# Altium project PCIe_to_M2E.PrjPcb (part 2 of 2)

## Sheet PowerControl.SchDoc
size C
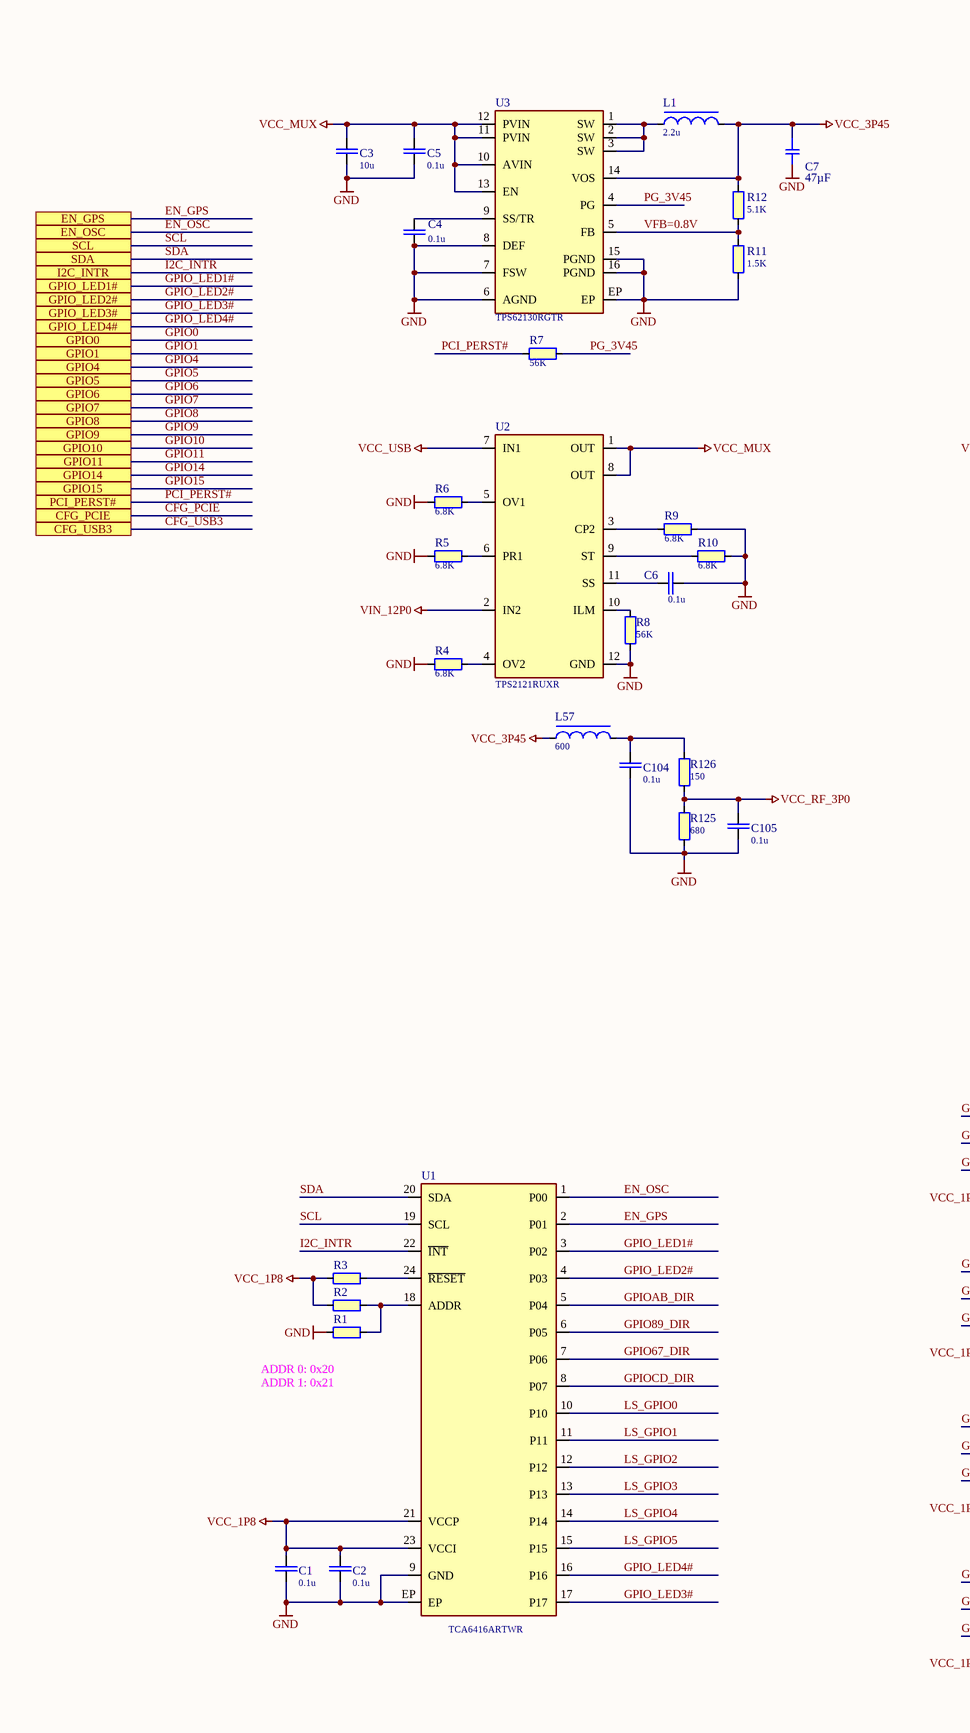
[diagram p4: PowerControl.SchDoc, left]
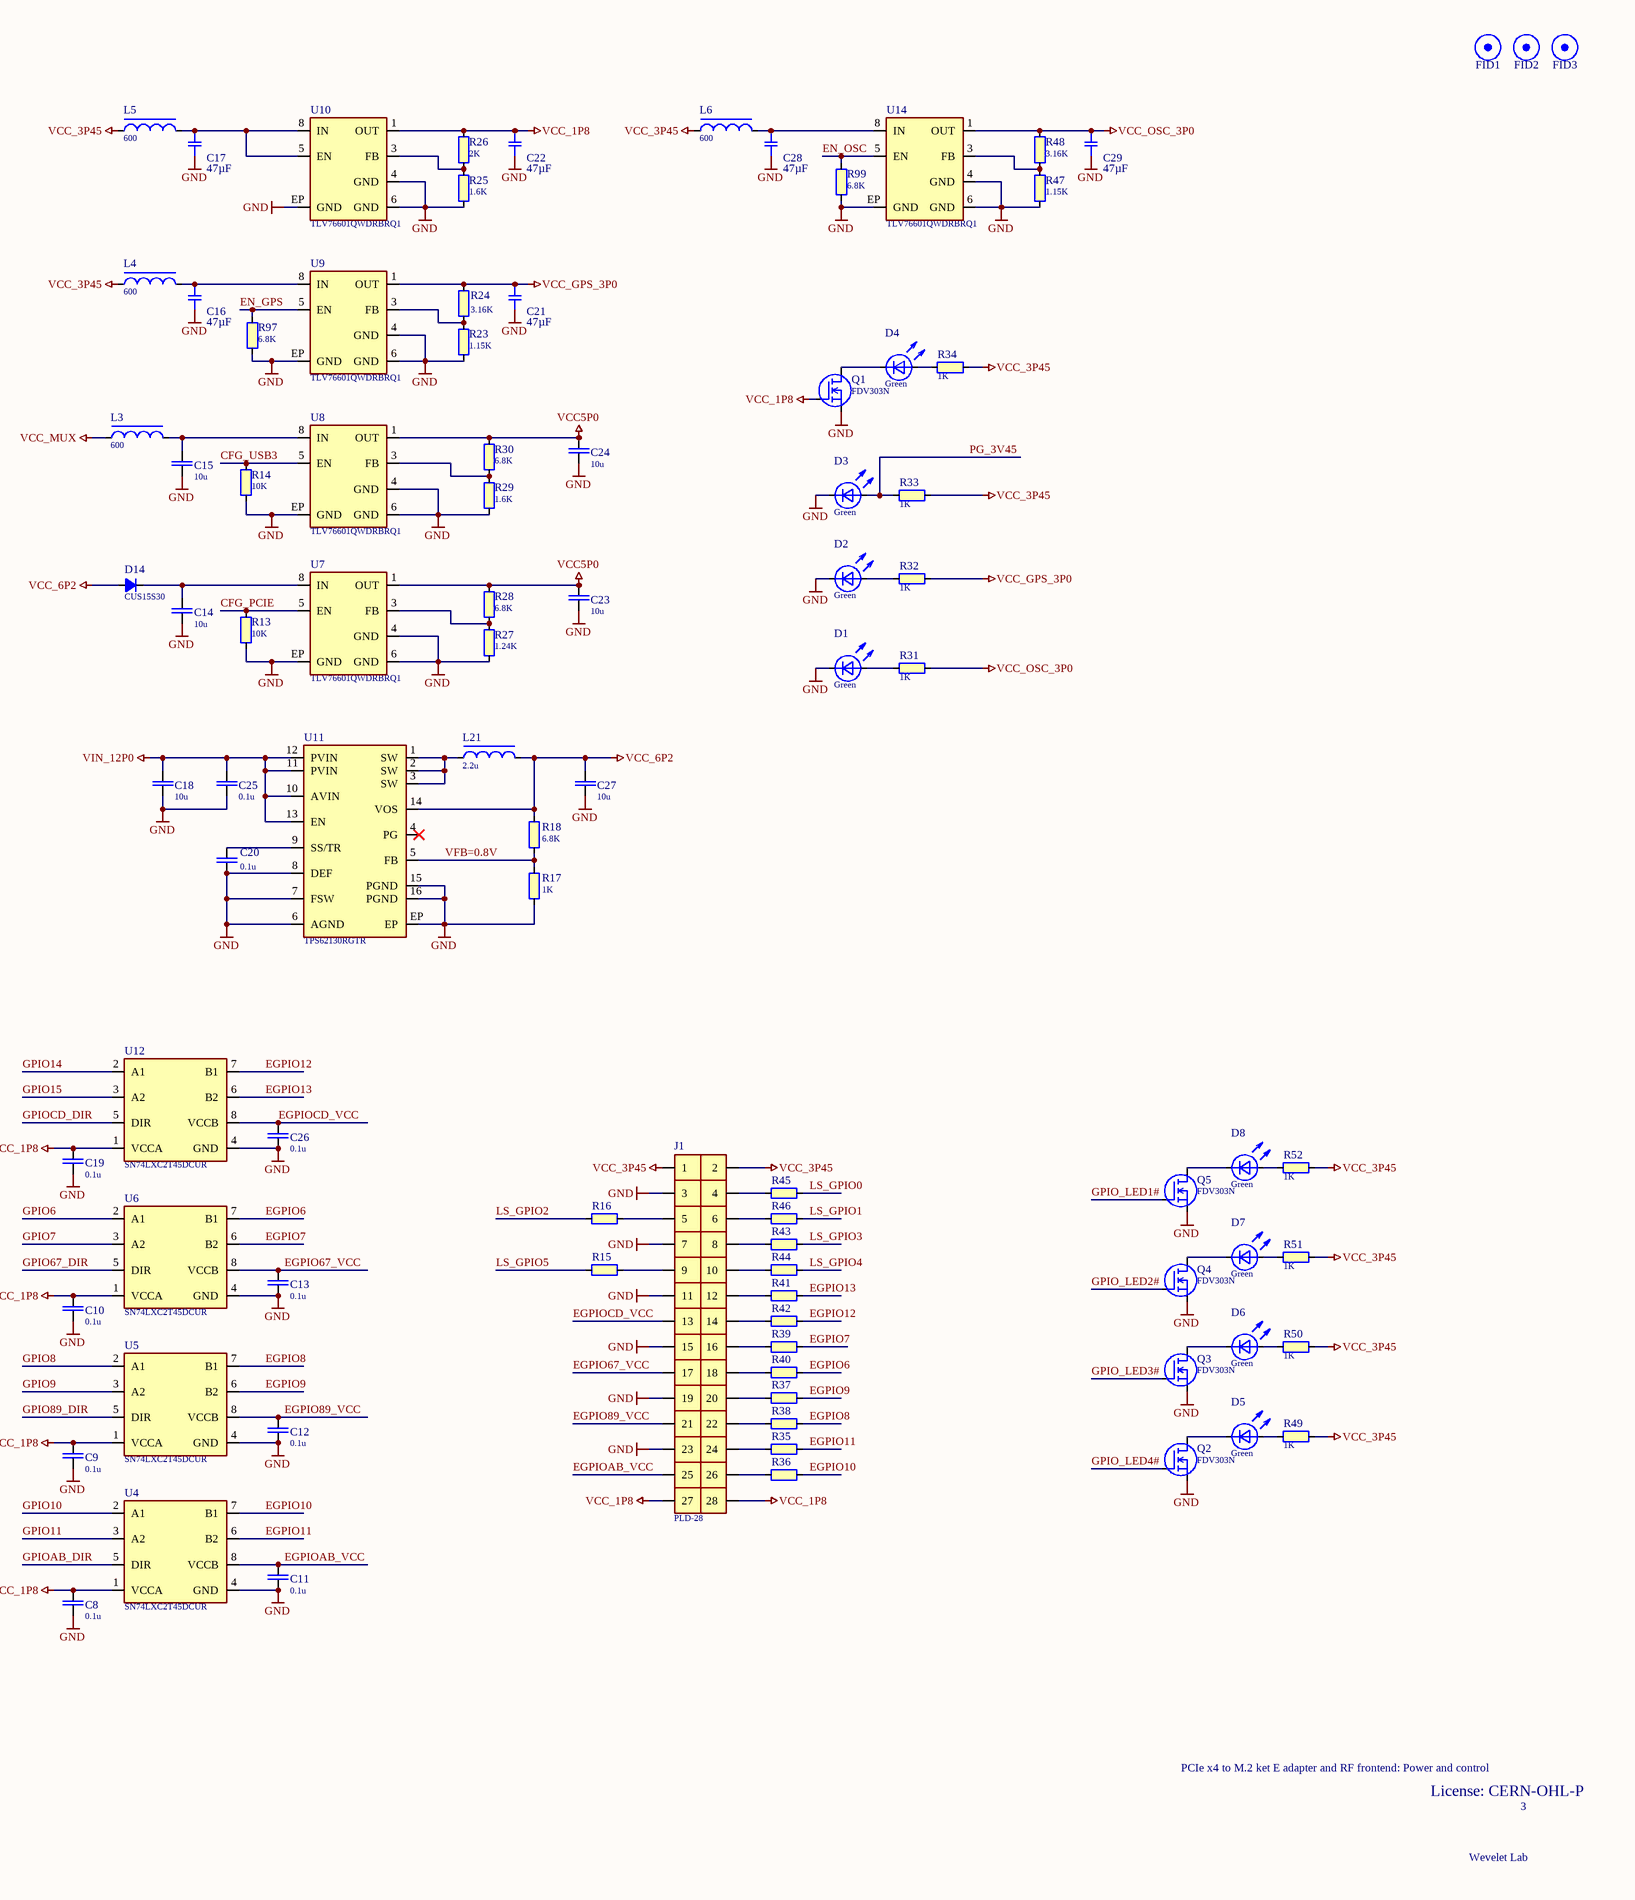
[diagram p5: PowerControl.SchDoc, right]

### Parts
C1  value 0.1u  [CAPC100X50X55L25N]  (hidden comment: GRM155R71E104KE14D)
C2  value 0.1u  [CAPC100X50X55L25N]  (hidden comment: GRM155R71E104KE14D)
C3  value 10u  [CAPC160X80X100L40N]  (hidden comment: Cap-0603-X5R-25V-10u-20%)
C4  value 0.1u  [CAPC100X50X55L25N]  (hidden comment: GRM155R71E104KE14D)
C5  value 0.1u  [CAPC100X50X55L25N]  (hidden comment: GRM155R71E104KE14D)
C6  value 0.1u  [CAPC100X50X55L25N]  (hidden comment: GRM155R71E104KE14D)
C7  value 47µF  [SMD-0603-CAP_HighDensity]  (hidden comment: GRM188C80G476ME01D)
C8  value 0.1u  [CAPC100X50X55L25N]  (hidden comment: GRM155R71E104KE14D)
C9  value 0.1u  [CAPC100X50X55L25N]  (hidden comment: GRM155R71E104KE14D)
C10  value 0.1u  [CAPC100X50X55L25N]  (hidden comment: GRM155R71E104KE14D)
C11  value 0.1u  [CAPC100X50X55L25N]  (hidden comment: GRM155R71E104KE14D)
C12  value 0.1u  [CAPC100X50X55L25N]  (hidden comment: GRM155R71E104KE14D)
C13  value 0.1u  [CAPC100X50X55L25N]  (hidden comment: GRM155R71E104KE14D)
C14  value 10u  [CAPC160X80X100L40N]  (hidden comment: Cap-0603-X5R-25V-10u-20%)
C15  value 10u  [CAPC160X80X100L40N]  (hidden comment: Cap-0603-X5R-25V-10u-20%)
C16  value 47µF  [SMD-0603-CAP_HighDensity]  (hidden comment: GRM188C80G476ME01D)
C17  value 47µF  [SMD-0603-CAP_HighDensity]  (hidden comment: GRM188C80G476ME01D)
C18  value 10u  [CAPC160X80X100L40N]  (hidden comment: Cap-0603-X5R-25V-10u-20%)
C19  value 0.1u  [CAPC100X50X55L25N]  (hidden comment: GRM155R71E104KE14D)
C20  value 0.1u  [CAPC100X50X55L25N]  (hidden comment: GRM155R71E104KE14D)
C21  value 47µF  [SMD-0603-CAP_HighDensity]  (hidden comment: GRM188C80G476ME01D)
C22  value 47µF  [SMD-0603-CAP_HighDensity]  (hidden comment: GRM188C80G476ME01D)
C23  value 10u  [CAPC160X80X100L40N]  (hidden comment: Cap-0603-X5R-25V-10u-20%)
C24  value 10u  [CAPC160X80X100L40N]  (hidden comment: Cap-0603-X5R-25V-10u-20%)
C25  value 0.1u  [CAPC100X50X55L25N]  (hidden comment: GRM155R71E104KE14D)
C26  value 0.1u  [CAPC100X50X55L25N]  (hidden comment: GRM155R71E104KE14D)
C27  value 10u  [CAPC160X80X100L40N]  (hidden comment: Cap-0603-X5R-25V-10u-20%)
C28  value 47µF  [SMD-0603-CAP_HighDensity]  (hidden comment: GRM188C80G476ME01D)
C29  value 47µF  [SMD-0603-CAP_HighDensity]  (hidden comment: GRM188C80G476ME01D)
C104  value 0.1u  [CAPC100X50X55L25N]  (hidden comment: GRM155R71E104KE14D)
C105  value 0.1u  [CAPC100X50X55L25N]  (hidden comment: GRM155R71E104KE14D)
D1  value Green  [LEDC160X80X80L40N-Green]  (hidden comment: LTST-C190KGKT)
D2  value Green  [LEDC160X80X80L40N-Green]  (hidden comment: LTST-C190KGKT)
D3  value Green  [LEDC160X80X80L40N-Green]  (hidden comment: LTST-C190KGKT)
D4  value Green  [LEDC160X80X80L40N-Green]  (hidden comment: LTST-C190KGKT)
D5  value Green  [LEDC160X80X80L40N-Green]  (hidden comment: LTST-C190KGKT)
D6  value Green  [LEDC160X80X80L40N-Green]  (hidden comment: LTST-C190KGKT)
D7  value Green  [LEDC160X80X80L40N-Green]  (hidden comment: LTST-C190KGKT)
D8  value Green  [LEDC160X80X80L40N-Green]  (hidden comment: LTST-C190KGKT)
D14  value CUS15S30  [INDC100X60X60L30N]  (hidden comment: CUS15S30,H3F)
FID1  Fiducial  [Fiducial_3D]  (value not drawn)  (no BOM)
FID2  Fiducial  [Fiducial_3D]  (value not drawn)  (no BOM)
FID3  Fiducial  [Fiducial_3D]  (value not drawn)  (no BOM)
J1  PLD-28  [PLD-28]
L1  value 2.2u  [IND_TAIYO_NRS5020]  (hidden comment: NRS5020T2R2NMGJ)
L3  value 600  [INDC100X60X60L30N]  (hidden comment: BLM15HG601SN1D)
L4  value 600  [INDC100X60X60L30N]  (hidden comment: BLM15HG601SN1D)
L5  value 600  [INDC100X60X60L30N]  (hidden comment: BLM15HG601SN1D)
L6  value 600  [INDC100X60X60L30N]  (hidden comment: BLM15HG601SN1D)
L21  value 2.2u  [IND_TAIYO_NRS5020]  (hidden comment: NRS5020T2R2NMGJ)
L57  value 600  [INDC100X60X60L30N]  (hidden comment: BLM15HG601SN1D)
Q1  FDV303N  [SOT23-3P95_245X110L45X44N]
Q2  FDV303N  [SOT23-3P95_245X110L45X44N]
Q3  FDV303N  [SOT23-3P95_245X110L45X44N]
Q4  FDV303N  [SOT23-3P95_245X110L45X44N]
Q5  FDV303N  [SOT23-3P95_245X110L45X44N]
R1  value DNP  [RESC100X50X40L20N]  (hidden comment: Res-0402-DNP)  (no BOM)
R2  value 33  [RESC100X50X40L20N]  (hidden comment: RC0402FR-0733RL)
R3  value 6.8K  [RESC100X50X40L20N]  (hidden comment: RC0402FR-076K8L)
R4  value 6.8K  [RESC100X50X40L20N]  (hidden comment: RC0402FR-076K8L)
R5  value 6.8K  [RESC100X50X40L20N]  (hidden comment: RC0402FR-076K8L)
R6  value 6.8K  [RESC100X50X40L20N]  (hidden comment: RC0402FR-076K8L)
R7  value 56K  [RESC100X50X40L20N]  (hidden comment: RC0402FR-0756KL)
R8  value 56K  [RESC100X50X40L20N]  (hidden comment: RC0402FR-0756KL)
R9  value 6.8K  [RESC100X50X40L20N]  (hidden comment: RC0402FR-076K8L)
R10  value 6.8K  [RESC100X50X40L20N]  (hidden comment: RC0402FR-076K8L)
R11  value 1.5K  [RESC100X50X40L20N]  (hidden comment: RC0402FR-071K5L)
R12  value 5.1K  [RESC100X50X40L20N]  (hidden comment: RC0402FR-075K1L)
R13  value 10K  [RESC100X50X40L20N]  (hidden comment: RC0402FR-0710KL)
R14  value 10K  [RESC100X50X40L20N]  (hidden comment: RC0402FR-0710KL)
R15  value 33  [RESC100X50X40L20N]  (hidden comment: RC0402FR-0733RL)
R16  value 33  [RESC100X50X40L20N]  (hidden comment: RC0402FR-0733RL)
R17  value 1K  [RESC100X50X40L20N]  (hidden comment: RC0402FR-071KL)
R18  value 6.8K  [RESC100X50X40L20N]  (hidden comment: RC0402FR-076K8L)
R23  value 1.15K  [RESC100X50X40L20N]  (hidden comment: RC0402FR-071K15L)
R24  value 3.16K  [RESC100X50X40L20N]  (hidden comment: RC0402FR-073K16L)
R25  value 1.6K  [RESC100X50X40L20N]  (hidden comment: RC0402FR-071K6L)
R26  value 2K  [RESC100X50X40L20N]  (hidden comment: RC0402FR-072KL)
R27  value 1.24K  [RESC100X50X40L20N]  (hidden comment: RC0402FR-071K24L)
R28  value 6.8K  [RESC100X50X40L20N]  (hidden comment: RC0402FR-076K8L)
R29  value 1.6K  [RESC100X50X40L20N]  (hidden comment: RC0402FR-071K6L)
R30  value 6.8K  [RESC100X50X40L20N]  (hidden comment: RC0402FR-076K8L)
R31  value 1K  [RESC100X50X40L20N]  (hidden comment: RC0402FR-071KL)
R32  value 1K  [RESC100X50X40L20N]  (hidden comment: RC0402FR-071KL)
R33  value 1K  [RESC100X50X40L20N]  (hidden comment: RC0402FR-071KL)
R34  value 1K  [RESC100X50X40L20N]  (hidden comment: RC0402FR-071KL)
R35  value 33  [RESC100X50X40L20N]  (hidden comment: RC0402FR-0733RL)
R36  value 33  [RESC100X50X40L20N]  (hidden comment: RC0402FR-0733RL)
R37  value 33  [RESC100X50X40L20N]  (hidden comment: RC0402FR-0733RL)
R38  value 33  [RESC100X50X40L20N]  (hidden comment: RC0402FR-0733RL)
R39  value 33  [RESC100X50X40L20N]  (hidden comment: RC0402FR-0733RL)
R40  value 33  [RESC100X50X40L20N]  (hidden comment: RC0402FR-0733RL)
R41  value 33  [RESC100X50X40L20N]  (hidden comment: RC0402FR-0733RL)
R42  value 33  [RESC100X50X40L20N]  (hidden comment: RC0402FR-0733RL)
R43  value 33  [RESC100X50X40L20N]  (hidden comment: RC0402FR-0733RL)
R44  value 33  [RESC100X50X40L20N]  (hidden comment: RC0402FR-0733RL)
R45  value 33  [RESC100X50X40L20N]  (hidden comment: RC0402FR-0733RL)
R46  value 33  [RESC100X50X40L20N]  (hidden comment: RC0402FR-0733RL)
R47  value 1.15K  [RESC100X50X40L20N]  (hidden comment: RC0402FR-071K15L)
R48  value 3.16K  [RESC100X50X40L20N]  (hidden comment: RC0402FR-073K16L)
R49  value 1K  [RESC100X50X40L20N]  (hidden comment: RC0402FR-071KL)
R50  value 1K  [RESC100X50X40L20N]  (hidden comment: RC0402FR-071KL)
R51  value 1K  [RESC100X50X40L20N]  (hidden comment: RC0402FR-071KL)
R52  value 1K  [RESC100X50X40L20N]  (hidden comment: RC0402FR-071KL)
R97  value 6.8K  [RESC100X50X40L20N]  (hidden comment: RC0402FR-076K8L)
R99  value 6.8K  [RESC100X50X40L20N]  (hidden comment: RC0402FR-076K8L)
R125  value 680  [RESC100X50X40L20N]  (hidden comment: RC0402FR-07680RL)
R126  value 150  [RESC100X50X40L20N]  (hidden comment: RC0402FR-07150RL)
U1  TCA6416ARTWR  [QFN25P50_400X400X80L40X24T250N]
U2  TPS2121RUXR  [QFN12P50_250X200X100L40X20N]
U3  TPS62130RGTR  [QFN17P50_300X300X100L40X24T170N]
U4  SN74LXC2T45DCUR  [SOP8P50_200X310X90L27X21N]
U5  SN74LXC2T45DCUR  [SOP8P50_200X310X90L27X21N]
U6  SN74LXC2T45DCUR  [SOP8P50_200X310X90L27X21N]
U7  TLV76601QWDRBRQ1  [SON9P65_300X300X100L40X31T250X175N]
U8  TLV76601QWDRBRQ1  [SON9P65_300X300X100L40X31T250X175N]
U9  TLV76601QWDRBRQ1  [SON9P65_300X300X100L40X31T250X175N]
U10  TLV76601QWDRBRQ1  [SON9P65_300X300X100L40X31T250X175N]
U11  TPS62130RGTR  [QFN17P50_300X300X100L40X24T170N]
U12  SN74LXC2T45DCUR  [SOP8P50_200X310X90L27X21N]
U14  TLV76601QWDRBRQ1  [SON9P65_300X300X100L40X31T250X175N]

### Ports
CFG_PCIE, CFG_USB3, EN_GPS, EN_OSC, GPIO0, GPIO1, GPIO4, GPIO5, GPIO6, GPIO7, GPIO8, GPIO9, GPIO10, GPIO11, GPIO14, GPIO15, GPIO_LED1#, GPIO_LED2#, GPIO_LED3#, GPIO_LED4#, I2C_INTR, PCI_PERST#, SCL, SDA

### Nets
GND: C1.1 C2.1 C3.2 C4.2 C5.2 C6.2 C7.2 C8.2 C9.2 C10.2 C11.1 C12.1 C13.1 C14.2 C15.2 C16.2 C17.2 C18.2 C19.2 C20.2 C21.2 C22.2 C23.2 C24.2 C25.2 C26.1 C27.2 C28.2 C29.2 C104.2 C105.2 D1.C D2.C D3.C J1.3 J1.7 J1.11 J1.15 J1.19 J1.23 Q1.2(S) Q2.2(S) Q3.2(S) Q4.2(S) Q5.2(S) R1.1 R4.1 R5.1 R6.1 R8.1 R9.2 R10.2 R11.1 R13.1 R14.1 R17.1 R23.1 R25.1 R27.1 R29.1 R47.1 R97.1 R99.1 R125.1 U1.9(GND) U1.EP U2.12(GND) U3.6(AGND) U3.7(FSW) U3.8(DEF) U3.15(PGND) U3.16(PGND) U3.EP U4.4(GND) U5.4(GND) U6.4(GND) U7.4(GND) U7.6(GND) U7.EP(GND) U8.4(GND) U8.6(GND) U8.EP(GND) U9.4(GND) U9.6(GND) U9.EP(GND) U10.4(GND) U10.6(GND) U10.EP(GND) U11.6(AGND) U11.7(FSW) U11.8(DEF) U11.15(PGND) U11.16(PGND) U11.EP U12.4(GND) U14.4(GND) U14.6(GND) U14.EP(GND)
VCC5P0: C23.1 C24.1 R28.2 R30.2 U7.1(OUT) U8.1(OUT)
VCC_1P8: C1.2 C2.2 C8.1 C9.1 C10.1 C19.1 C22.1 J1.27 J1.28 Q1.1(G) R2.1 R3.1 R26.2 U1.21(VCCP) U1.23(VCCI) U4.1(VCCA) U5.1(VCCA) U6.1(VCCA) U10.1(OUT) U12.1(VCCA)
VCC_3P45: C7.1 J1.1 J1.2 L1.2 L4.1 L5.1 L6.1 L57.1 R12.2 R33.2 R34.2 R49.2 R50.2 R51.2 R52.2 U3.14(VOS)
VCC_6P2: C27.1 D14.A L21.2 R18.2 U11.14(VOS)
VCC_GPS_3P0: C21.1 R24.2 R32.2 U9.1(OUT)
VCC_MUX: C3.1 C5.1 L3.1 U2.1(OUT) U2.8(OUT) U3.10(AVIN) U3.11(PVIN) U3.12(PVIN) U3.13(EN)
VCC_OSC_3P0: C29.1 R31.2 R48.2 U14.1(OUT)
VCC_RF_3P0: C105.1 R125.2 R126.1
VCC_USB: U2.7(IN1)
VIN_12P0: C18.1 C25.1 U2.2(IN2) U11.10(AVIN) U11.11(PVIN) U11.12(PVIN) U11.13(EN)
CFG_PCIE: R13.2 U7.5(EN) ; port CFG_PCIE
CFG_USB3: R14.2 U8.5(EN) ; port CFG_USB3
EGPIO6: R40.2 U6.7(B1)
EGPIO7: R39.2 U6.6(B2)
EGPIO8: R38.2 U5.7(B1)
EGPIO9: R37.2 U5.6(B2)
EGPIO10: R36.2 U4.7(B1)
EGPIO11: R35.2 U4.6(B2)
EGPIO12: R42.2 U12.7(B1)
EGPIO13: R41.2 U12.6(B2)
EGPIO67_VCC: C13.2 J1.17 U6.8(VCCB)
EGPIO89_VCC: C12.2 J1.21 U5.8(VCCB)
EGPIOAB_VCC: C11.2 J1.25 U4.8(VCCB)
EGPIOCD_VCC: C26.2 J1.13 U12.8(VCCB)
EN_GPS: R97.2 U1.2(P01) U9.5(EN) ; port EN_GPS
EN_OSC: R99.2 U1.1(P00) U14.5(EN) ; port EN_OSC
GPIO6: U6.2(A1) ; port GPIO6
GPIO7: U6.3(A2) ; port GPIO7
GPIO8: U5.2(A1) ; port GPIO8
GPIO9: U5.3(A2) ; port GPIO9
GPIO10: U4.2(A1) ; port GPIO10
GPIO11: U4.3(A2) ; port GPIO11
GPIO14: U12.2(A1) ; port GPIO14
GPIO15: U12.3(A2) ; port GPIO15
GPIO67_DIR: U1.7(P06) U6.5(DIR)
GPIO89_DIR: U1.6(P05) U5.5(DIR)
GPIO_LED1#: Q5.1(G) U1.3(P02) ; port GPIO_LED1#
GPIO_LED2#: Q4.1(G) U1.4(P03) ; port GPIO_LED2#
GPIO_LED3#: Q3.1(G) U1.17(P17) ; port GPIO_LED3#
GPIO_LED4#: Q2.1(G) U1.16(P16) ; port GPIO_LED4#
GPIOAB_DIR: U1.5(P04) U4.5(DIR)
GPIOCD_DIR: U1.8(P07) U12.5(DIR)
I2C_INTR: U1.22(~{INT}) ; port I2C_INTR
LS_GPIO0: R45.2 U1.10(P10)
LS_GPIO1: R46.2 U1.11(P11)
LS_GPIO2: R16.1 U1.12(P12)
LS_GPIO3: R43.2 U1.13(P13)
LS_GPIO4: R44.2 U1.14(P14)
LS_GPIO5: R15.1 U1.15(P15)
PCI_PERST#: R7.1 ; port PCI_PERST#
PG_3V45: D3.A R7.2 R33.1 U3.4(PG)
SCL: U1.19(SCL) ; port SCL
SDA: U1.20(SDA) ; port SDA
NetC4_1: C4.1 U3.9(SS/TR)
NetC6_1: C6.1 U2.11(SS)
NetC14_1: C14.1 D14.C U7.8(IN)
NetC15_1: C15.1 L3.2 U8.8(IN)
NetC16_1: C16.1 L4.2 U9.8(IN)
NetC17_1: C17.1 L5.2 U10.5(EN) U10.8(IN)
NetC20_1: C20.1 U11.9(SS/TR)
NetC28_1: C28.1 L6.2 U14.8(IN)
NetC104_1: C104.1 L57.2 R126.2
NetD1_A: D1.A R31.1
NetD2_A: D2.A R32.1
NetD4_A: D4.A R34.1
NetD4_C: D4.C Q1.3(D)
NetD5_A: D5.A R49.1
NetD5_C: D5.C Q2.3(D)
NetD6_A: D6.A R50.1
NetD6_C: D6.C Q3.3(D)
NetD7_A: D7.A R51.1
NetD7_C: D7.C Q4.3(D)
NetD8_A: D8.A R52.1
NetD8_C: D8.C Q5.3(D)
NetJ1_4: J1.4 R45.1
NetJ1_5: J1.5 R16.2
NetJ1_6: J1.6 R46.1
NetJ1_8: J1.8 R43.1
NetJ1_9: J1.9 R15.2
NetJ1_10: J1.10 R44.1
NetJ1_12: J1.12 R41.1
NetJ1_14: J1.14 R42.1
NetJ1_16: J1.16 R39.1
NetJ1_18: J1.18 R40.1
NetJ1_20: J1.20 R37.1
NetJ1_22: J1.22 R38.1
NetJ1_24: J1.24 R35.1
NetJ1_26: J1.26 R36.1
NetL1_1: L1.1 U3.1(SW) U3.2(SW) U3.3(SW)
NetL21_1: L21.1 U11.1(SW) U11.2(SW) U11.3(SW)
NetR1_2: R1.2 R2.2 U1.18(ADDR)
NetR3_2: R3.2 U1.24(~{RESET})
NetR4_2: R4.2 U2.4(OV2)
NetR5_2: R5.2 U2.6(PR1)
NetR6_2: R6.2 U2.5(OV1)
NetR8_2: R8.2 U2.10(ILM)
NetR9_1: R9.1 U2.3(CP2)
NetR10_1: R10.1 U2.9(ST)
NetR11_2: R11.2 R12.1 U3.5(FB)
NetR17_2: R17.2 R18.1 U11.5(FB)
NetR23_2: R23.2 R24.1 U9.3(FB)
NetR25_2: R25.2 R26.1 U10.3(FB)
NetR27_2: R27.2 R28.1 U7.3(FB)
NetR29_2: R29.2 R30.1 U8.3(FB)
NetR47_2: R47.2 R48.1 U14.3(FB)

Not connected (* = marked no-connect by the designer): U11 4(PG)*

### Notes on the sheet
- VFB=0.8V
- (near R1) ADDR 0: 0x20
- (near R1) ADDR 1: 0x21
- PCIe x4 to M.2 ket E adapter and RF frontend: Power and control
- License: CERN-OHL-P
- Wevelet Lab
- 3

### Library data of the parts
C1 C2 C4-C6 C8-C13 C19 C20 C25 C26 C104 C105 = GRM155R71E104KE14D: Capacitor, 0.1u, 25V, 10%, X7R, 0402; Manufacturer: Murata Electronics
C3 C14 C15 C18 C23 C24 C27 = Cap-0603-X5R-25V-10u-20%: Capacitor, 10u, 25V, 20%, X5R, 0603; Manufacturer: *
C7 C16 C17 C21 C22 C28 C29 = GRM188C80G476ME01D: CAP CER 47UF 4V X6S 0603; Manufacturer: Murata Electronics North America; Tolerance: ±20%; Datasheets: https://www.murata.com/-/media/webrenewal/support/library/catalog/products/capacitor/ceramiccapacitor/c02e.ashx?la=en-us&cvid=20210120024548000000; Digi-Key Part Number: 490-13246-2-ND; Part Number: GRM188C80G476ME01D; Series: GRM; Part Status: Active; Voltage: 4V; Temperature Coefficient: X6S; Operating Temperature: -55°C ~ 105°C; Applications: General Purpose; Failure Rate: Surface Mount, MLCC; Mounting Type: 0603 (1608 Metric); Package / Case: 0.063" L x 0.031" W (1.60mm x 0.80mm)
D1-D8 = LTST-C190KGKT: LED Diode, Green, -30/+85, SMD0603; Manufacturer: Lite-On Inc.
D14 = CUS15S30: Diode, Schottky, 20V, 1.5A, 0.3Vf, -50/+125, SOD-323-2; Manufacturer: Toshiba
J1 = PLD-28: Conn, Header 12x2, 2.54mm, Trough Hole; Manufacturer: *; Value: PLD-28
L1 L21 = NRS5020T2R2NMGJ: Inductor, 2.2u, 2,9A, 42mOhm, +/-30%, -25/+125, SMD; Manufacturer: Taiyo Yuden
L3-L6 L57 = BLM15HG601SN1D: Ferrite bead, 600Ohm@100MHz, 0,3A, 700mOhm, -55/+125, SMD0402; Manufacturer: Murata Electronics; Name: BLM15HG601SN1D
Q1-Q5 = FDV303N: Transistor, MOSFET, N-CH, 25V, 0.68A, -55/+150, SOT-23; Manufacturer: Onsemi; Value: FDV303N
R1 = Res-0402-DNP: Resistor, DNP, 0.063W, 5%, 0402; Manufacturer: *
R2 R15 R16 R35-R46 = Res-0402-33-5%: Resistor, 33, 0.063W, 5%, 0402; Manufacturer: *; Name: RC0402FR-0733RL
R3-R6 R9 R10 R18 R28 R30 R97 R99 = Res-0402-6.8K-1%: Resistor, 6.8K, 0.063W, 1%, 0402; Manufacturer: *; Name: RC0402FR-076K8L
R7 R8 = Res-0402-56K-5%: Resistor, 56K, 0.063W, 5%, 0402; Manufacturer: *; Name: RC0402FR-0756KL
R11 = Res-0402-1.5K-1%: Resistor, 1.5K, 0.063W, 1%, 0402; Manufacturer: *; Name: RC0402FR-071K5L
R12 = Res-0402-5.1K-1%: Resistor, 5.1K, 0.063W, 1%, 0402; Manufacturer: *; Name: RC0402FR-075K1L
R13 R14 = Res-0402-10K-5%: Resistor, 10K, 0.063W, 5%, 0402; Manufacturer: *; Name: RC0402FR-0710KL
R17 R31-R34 R49-R52 = Res-0402-1K-5%: Resistor, 1K, 0.063W, 5%, 0402; Manufacturer: *; Name: RC0402FR-071KL
R23 R47 = Res-0402-1.15K-1%: Resistor, 1.15K, 0.063W, 1%, 0402; Manufacturer: *; Name: RC0402FR-071K15L
R24 R48 = Res-0402-3.16K-1%: Resistor, 3.16K, 0.063W, 1%, 0402; Manufacturer: *; Name: RC0402FR-073K16L
R25 R29 = Res-0402-1.6K-1%: Resistor, 1.6K, 0.063W, 1%, 0402; Manufacturer: *; Name: RC0402FR-071K6L
R26 = Res-0402-2K-1%: Resistor, 2K, 0.063W, 1%, 0402; Manufacturer: *; Name: RC0402FR-072KL
R27 = Res-0402-1.24K-1%: Resistor, 1.24K, 0.063W, 1%, 0402; Manufacturer: *; Name: RC0402FR-071K24L
R125 = Res-0402-680-5%: Resistor, 680, 0.063W, 5%, 0402; Manufacturer: *; Name: RC0402FR-07680RL
R126 = Res-0402-150-5%: Resistor, 150, 0.063W, 5%, 0402; Manufacturer: *; Name: RC0402FR-07150RL
U1 = TCA6416ARTWR: IC, Expander, 16-bit, 400KHZ, I2C, SMBUS, 1.65-5.5V, -40/+85, 24-WQFN (4x4); Manufacturer: TI; Value: TCA6416ARTWR
U2 = TPS2121RUXR: IC, QR controller, 2:1, 2.8/24V, 1/4.5A, -40/+125, VQFN-12; Manufacturer: Texas Instruments; Value: TPS2121RUXR
U3 U11 = TPS62130RGTR: IC, DC/DC, Step-Down, 3-17/0.9-6V, 3A, -40/+85, QFN-16; Manufacturer: Texas Instruments; Value: TPS62130RGTR
U4-U6 U12 = SN74LXC2T45DCUR: IC, Transceiver, Bidirectional, 1.1-5.5V, -40/+125, 8VSSOP; Manufacturer: TI; Value: SN74LXC2T45DCUR
U7-U10 U14 = TLV76601QWDRBRQ1: IC, VolReg, DC/DC, 2.5/16V, 0.8/14,6V, 0.5A, -40/+150, 8-SON; Manufacturer: Texas Instruments; Value: TLV76601QWDRBRQ1
FID1-FID3 = Fiducial: Manufacturer: *; Value: *

## Sheet RFEv2_1.SchDoc
size A3
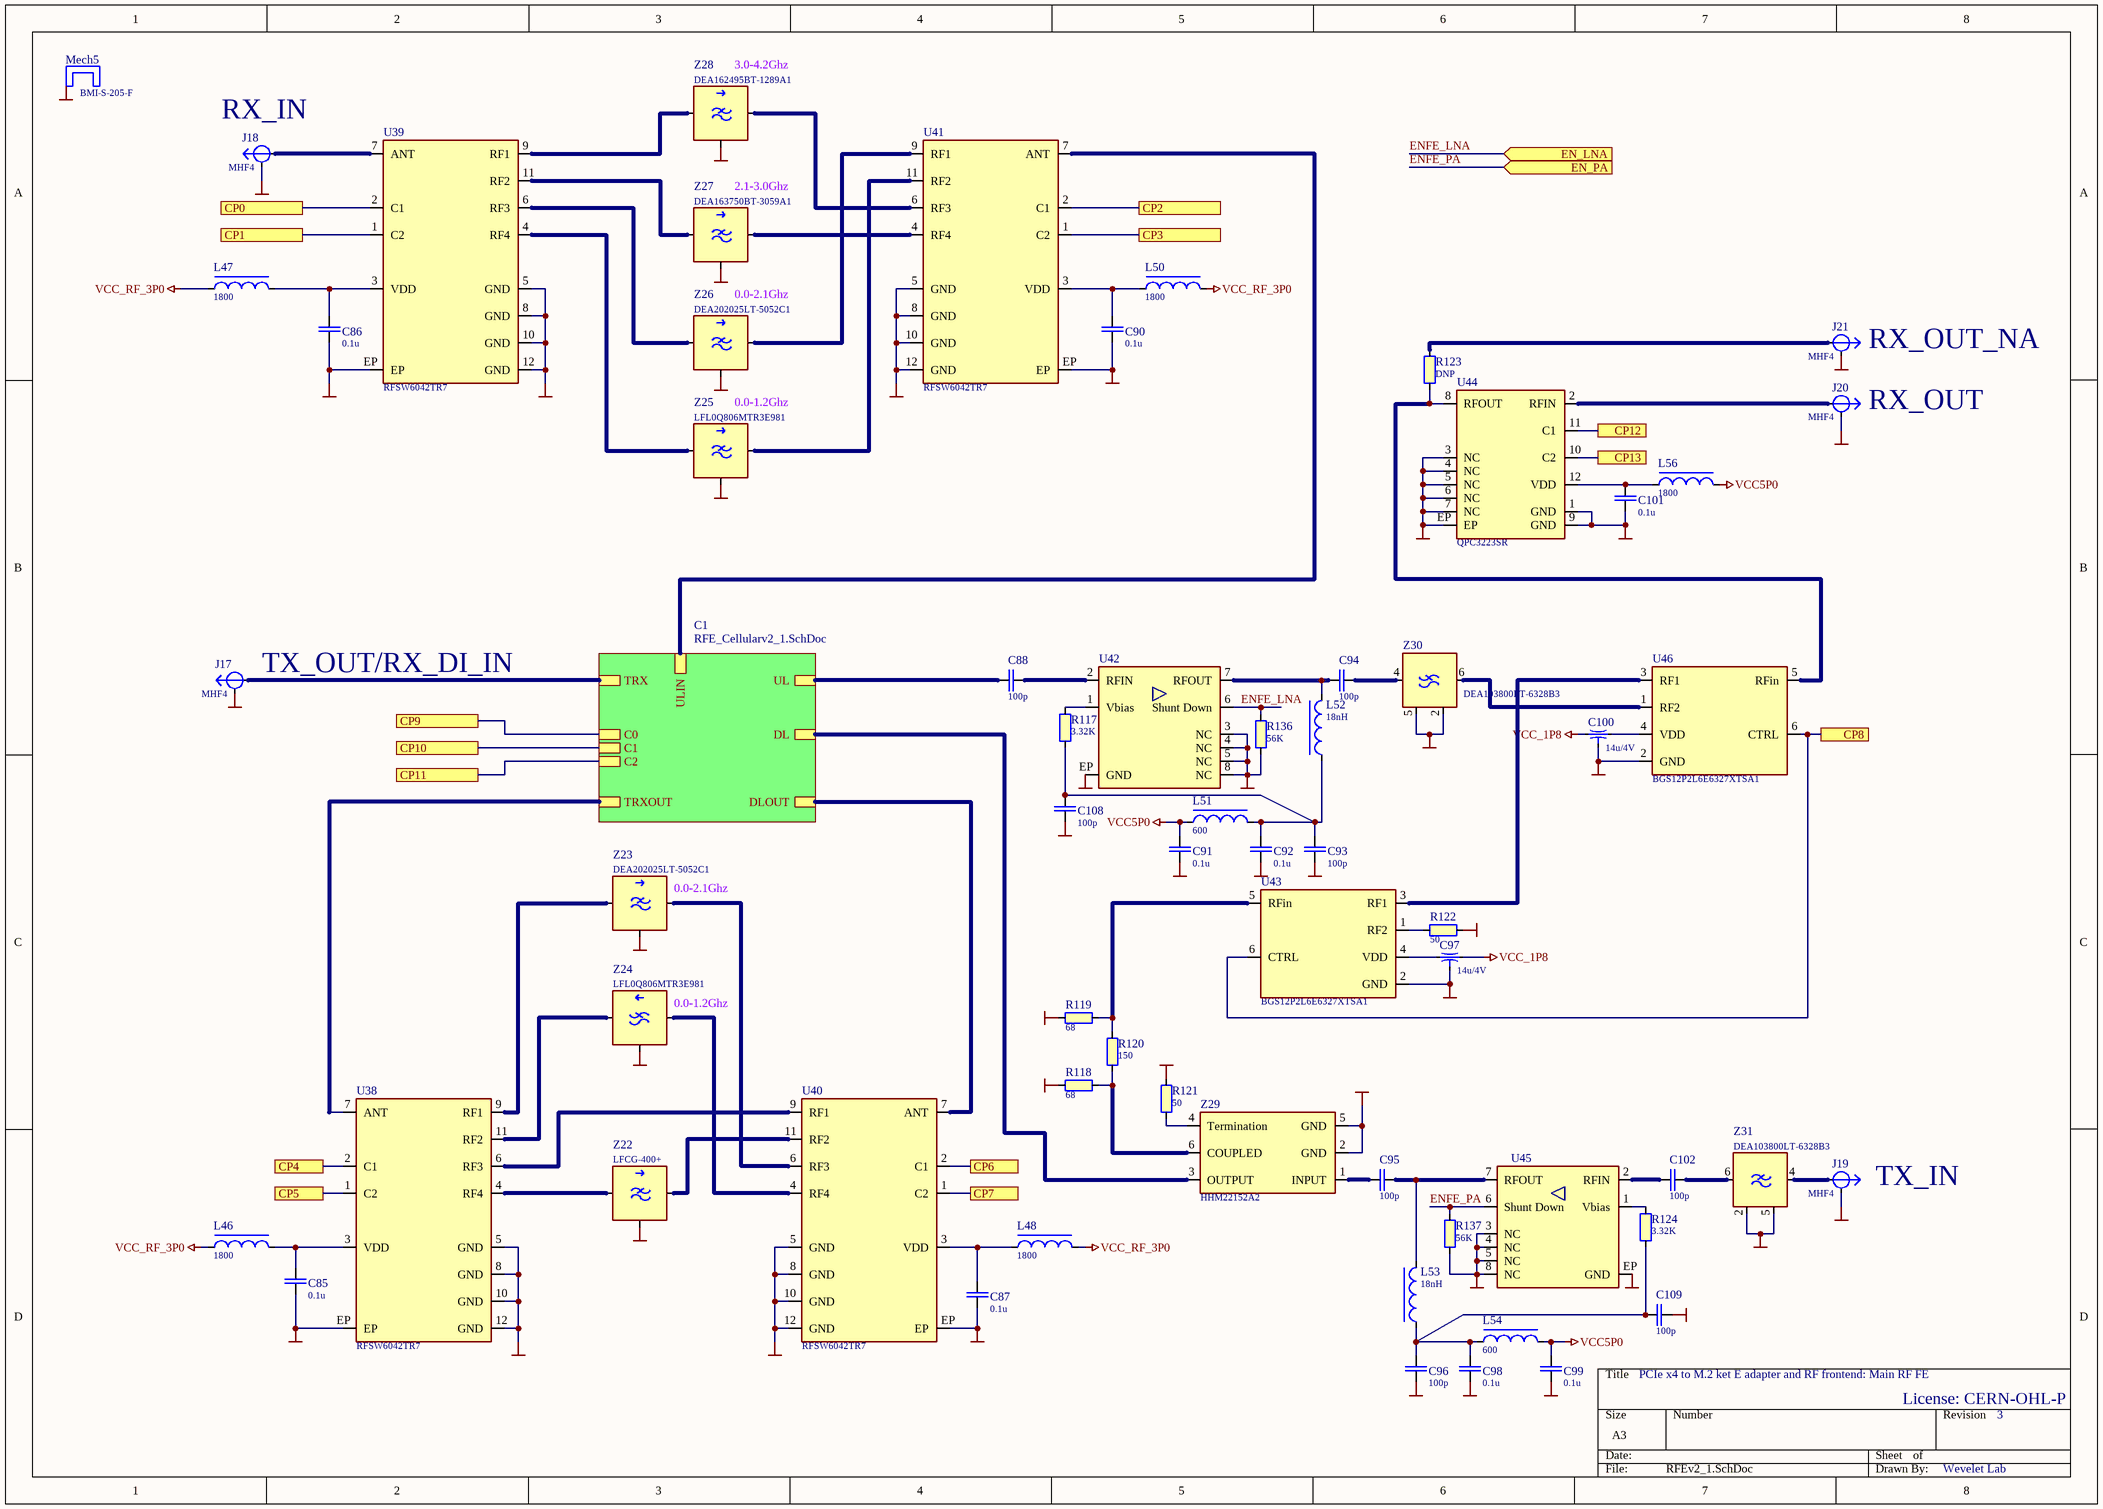
[diagram p6: RFEv2_1.SchDoc]

### Parts
C85  value 0.1u  [CAPC100X50X55L25N]  (hidden comment: GRM155R71E104KE14D)
C86  value 0.1u  [CAPC100X50X55L25N]  (hidden comment: GRM155R71E104KE14D)
C87  value 0.1u  [CAPC100X50X55L25N]  (hidden comment: GRM155R71E104KE14D)
C88  value 100p  [CAPC100X50X55L25N]  (hidden comment: Cap-0402-NP0-50V-100p-20%)
C90  value 0.1u  [CAPC100X50X55L25N]  (hidden comment: GRM155R71E104KE14D)
C91  value 0.1u  [CAPC100X50X55L25N]  (hidden comment: GRM155R71E104KE14D)
C92  value 0.1u  [CAPC100X50X55L25N]  (hidden comment: GRM155R71E104KE14D)
C93  value 100p  [CAPC100X50X55L25N]  (hidden comment: Cap-0402-NP0-50V-100p-20%)
C94  value 100p  [CAPC100X50X55L25N]  (hidden comment: Cap-0402-NP0-50V-100p-20%)
C95  value 100p  [CAPC100X50X55L25N]  (hidden comment: Cap-0402-NP0-50V-100p-20%)
C96  value 100p  [CAPC100X50X55L25N]  (hidden comment: Cap-0402-NP0-50V-100p-20%)
C97  value 14u/4V  [CAPCEMI100X50X50L20N]  (hidden comment: NFM15PC146R0G3D)
C98  value 0.1u  [CAPC100X50X55L25N]  (hidden comment: GRM155R71E104KE14D)
C99  value 0.1u  [CAPC100X50X55L25N]  (hidden comment: GRM155R71E104KE14D)
C100  value 14u/4V  [CAPCEMI100X50X50L20N]  (hidden comment: NFM15PC146R0G3D)
C101  value 0.1u  [CAPC100X50X55L25N]  (hidden comment: GRM155R71E104KE14D)
C102  value 100p  [CAPC100X50X55L25N]  (hidden comment: Cap-0402-NP0-50V-100p-20%)
C108  value 100p  [CAPC100X50X55L25N]  (hidden comment: Cap-0402-NP0-50V-100p-20%)
C109  value 100p  [CAPC100X50X55L25N]  (hidden comment: Cap-0402-NP0-50V-100p-20%)
J17  value MHF4  [LINX_CONMHF4-SMD-G-T]  (hidden comment: CONMHF4-SMD-G-T)
J18  value MHF4  [LINX_CONMHF4-SMD-G-T]  (hidden comment: CONMHF4-SMD-G-T)
J19  value MHF4  [LINX_CONMHF4-SMD-G-T]  (hidden comment: CONMHF4-SMD-G-T)
J20  value MHF4  [LINX_CONMHF4-SMD-G-T]  (hidden comment: CONMHF4-SMD-G-T)
J21  value MHF4  [LINX_CONMHF4-SMD-G-T]  (hidden comment: CONMHF4-SMD-G-T)
L46  value 1800  [INDC100X60X60L30N]  (hidden comment: BLM15HD182SN1D)
L47  value 1800  [INDC100X60X60L30N]  (hidden comment: BLM15HD182SN1D)
L48  value 1800  [INDC100X60X60L30N]  (hidden comment: BLM15HD182SN1D)
L50  value 1800  [INDC100X60X60L30N]  (hidden comment: BLM15HD182SN1D)
L51  value 600  [INDC100X60X60L30N]  (hidden comment: BLM15HG601SN1D)
L52  value 18nH  [CAPC100X50X55L25N]  (hidden comment: MLK1005S18NJT000)
L53  value 18nH  [CAPC100X50X55L25N]  (hidden comment: MLK1005S18NJT000)
L54  value 600  [INDC100X60X60L30N]  (hidden comment: BLM15HG601SN1D)
L56  value 1800  [INDC100X60X60L30N]  (hidden comment: BLM15HD182SN1D)
Mech5  BMI-S-205-F  [LAIRD_BMI-S-205]
R117  value 3.32K  [RESC100X50X40L20N]  (hidden comment: RC0402FR-073K32L)
R118  value 68  [RESC100X50X40L20N]  (hidden comment: RC0402FR-0768RL)
R119  value 68  [RESC100X50X40L20N]  (hidden comment: RC0402FR-0768RL)
R120  value 150  [RESC100X50X40L20N]  (hidden comment: RC0402FR-07150RL)
R121  value 50  [RESC100X50X40L20N]  (hidden comment: RC0402FR-0750RL)
R122  value 50  [RESC100X50X40L20N]  (hidden comment: RC0402FR-0750RL)
R123  value DNP  [RESC100X50X40L20N]  (hidden comment: Res-0402-DNP)  (no BOM)
R124  value 3.32K  [RESC100X50X40L20N]  (hidden comment: RC0402FR-073K32L)
R136  value 56K  [RESC100X50X40L20N]  (hidden comment: RC0402FR-0756KL)
R137  value 56K  [RESC100X50X40L20N]  (hidden comment: RC0402FR-0756KL)
U38  RFSW6042TR7  [QFN13P40_180X180X60L25X18T80N]
U39  RFSW6042TR7  [QFN13P40_180X180X60L25X18T80N]
U40  RFSW6042TR7  [QFN13P40_180X180X60L25X18T80N]
U41  RFSW6042TR7  [QFN13P40_180X180X60L25X18T80N]
U42  QPL9547TR7  [SON9P50_200X200X100L30X25T160X80N]
U43  BGS12P2L6E6327XTSA1  [PSON6P40_110X70X32L20X20N]
U44  QPC3223SR  [QFN13P50_300X300X90L50X23T120N]
U45  QPL9547TR7  [SON9P50_200X200X100L30X25T160X80N]
U46  BGS12P2L6E6327XTSA1  [PSON6P40_110X70X32L20X20N]
Z22  LFCG-400+  [Mini-Circuits_ GE0805C-2]
Z23  DEA202025LT-5052C1  [TDK_DEA202025LT-5052C1]
Z24  LFL0Q806MTR3E981  [MURATA_LFL0Q806MTR3E981]
Z25  LFL0Q806MTR3E981  [MURATA_LFL0Q806MTR3E981]
Z26  DEA202025LT-5052C1  [TDK_DEA202025LT-5052C1]
Z27  DEA163750BT-3059A1  [TDK_DEA163750BT-3059A1]
Z28  DEA162495BT-1289A1  [TDK_DEA162495BT-1289A1]
Z29  HHM22152A2  [TDK_HHM22152A2]
Z30  DEA103800LT-6328B3  [TDK_DEA10-L]
Z31  DEA103800LT-6328B3  [TDK_DEA10-L]

### Sub-sheets
C1 = RFE_Cellularv2_1.SchDoc: TRX, UL, DL, C0, C1, C2, ULIN, DLOUT, TRXOUT

### Ports
CP0, CP1, CP2, CP3, CP4, CP5, CP6, CP7, CP8, CP9, CP10, CP11, CP12, CP13, EN_LNA (in), EN_PA (in)

### Nets
GND: C85.2 C86.2 C87.2 C90.2 C91.2 C92.2 C93.1 C96.1 C97.2(GND) C98.2 C99.2 C100.2(GND) C101.2 C108.1 C109.1 J17.SH J18.SH J19.SH J20.SH J21.SH Mech5.SH R118.1 R119.1 R121.2 R122.2 R136.1 R137.1 U38.5(GND) U38.8(GND) U38.10(GND) U38.12(GND) U38.EP U39.5(GND) U39.8(GND) U39.10(GND) U39.12(GND) U39.EP U40.5(GND) U40.8(GND) U40.10(GND) U40.12(GND) U40.EP U41.5(GND) U41.8(GND) U41.10(GND) U41.12(GND) U41.EP U42.3(NC) U42.4(NC) U42.5(NC) U42.8(NC) U42.EP(GND) U43.2(GND) U44.1(GND) U44.3(NC) U44.4(NC) U44.5(NC) U44.6(NC) U44.7(NC) U44.9(GND) U44.EP U45.3(NC) U45.4(NC) U45.5(NC) U45.8(NC) U45.EP(GND) U46.2(GND) Z22.2 Z23.2 Z24.3 Z25.3 Z26.2 Z27.2 Z28.2 Z29.2(GND) Z29.5(GND) Z30.2 Z30.5 Z31.2 Z31.5
VCC5P0: C91.1 C99.1 L51.2 L54.2 L56.1
VCC_1P8: C97.1 C100.1
VCC_RF_3P0: L46.1 L47.1 L48.2 L50.2
ENFE_LNA: R136.2 U42.6(Shunt_Down) ; port EN_LNA  [project net EN_RFE_LNA2]
ENFE_PA: R137.2 U45.6(Shunt_Down) ; port EN_PA  [project net EN_RFE2]
FGCP8: U43.6(CTRL) U46.6(CTRL) ; port CP8
FGCP12: U44.11(C1) ; port CP12
FGCP13: U44.10(C2) ; port CP13
GCP0: U39.2(C1) U41.2(C1) ; port CP2, port CP0
GCP1: U39.1(C2) ; port CP1
GCP3: U41.1(C2) ; port CP3
GCP4: U38.2(C1) U40.2(C1) ; port CP6, port CP4
GCP5: U38.1(C2) ; port CP5
GCP7: U40.1(C2) ; port CP7
GCP9: port CP9, sheet C1/C0
GCP10: port CP10, sheet C1/C1
GCP11: port CP11, sheet C1/C2
NetC85_1: C85.1 L46.2 U38.3(VDD)
NetC86_1: C86.1 L47.2 U39.3(VDD)
NetC87_1: C87.1 L48.1 U40.3(VDD)
NetC88_1: C88.1 ; sheet C1/UL
NetC88_2: C88.2 U42.2(RFIN)
NetC90_1: C90.1 L50.1 U41.3(VDD)
NetC92_1: C92.1 C93.2 C108.2 L51.1 L52.1 R117.1
NetC94_1: C94.1 L52.2 U42.7(RFOUT)
NetC94_2: C94.2 Z30.4
NetC95_1: C95.1 Z29.1(INPUT)
NetC95_2: C95.2 L53.2 U45.7(RFOUT)
NetC96_2: C96.2 C98.1 C109.2 L53.1 L54.1 R124.2
NetC97_3: C97.3 U43.4(VDD)
NetC100_3: C100.3 U46.4(VDD)
NetC101_1: C101.1 L56.2 U44.12(VDD)
NetC102_1: C102.1 U45.2(RFIN)
NetC102_2: C102.2 Z31.6
NetJ17_1: J17.1 ; sheet C1/TRX
NetJ18_1: J18.1 U39.7(ANT)
NetJ19_1: J19.1 Z31.4
NetJ20_1: J20.1 U44.2(RFIN)
NetJ21_1: J21.1 R123.1
NetR117_2: R117.2 U42.1(Vbias)
NetR118_2: R118.2 R120.2 Z29.6(COUPLED)
NetR119_2: R119.2 R120.1 U43.5(RFin)
NetR121_1: R121.1 Z29.4(Termination)
NetR122_1: R122.1 U43.1(RF2)
NetR123_2: R123.2 U44.8(RFOUT) U46.5(RFin)
NetR124_1: R124.1 U45.1(Vbias)
NetU35_7: U38.7(ANT) ; sheet C1/TRXOUT
NetU36_7: U40.7(ANT) ; sheet C1/DLOUT
NetU36_9: Z29.3(OUTPUT) ; sheet C1/DL
NetU37_7: U41.7(ANT) ; sheet C1/ULIN
NetU38_4: U38.4(RF4) Z22.1
NetU38_6: U38.6(RF3) U40.9(RF1)
NetU38_9: U38.9(RF1) Z23.1
NetU38_11: U38.11(RF2) Z24.1
NetU39_4: U39.4(RF4) Z25.2
NetU39_6: U39.6(RF3) Z26.1
NetU39_9: U39.9(RF1) Z28.1
NetU39_11: U39.11(RF2) Z27.1
NetU40_4: U40.4(RF4) Z24.2
NetU40_6: U40.6(RF3) Z23.3
NetU40_11: U40.11(RF2) Z22.3
NetU41_4: U41.4(RF4) Z27.3
NetU41_6: U41.6(RF3) Z28.3
NetU41_9: U41.9(RF1) Z26.3
NetU41_11: U41.11(RF2) Z25.1
NetU43_3: U43.3(RF1) U46.3(RF1)
NetU46_1: U46.1(RF2) Z30.6

### Notes on the sheet
- (near Z28) 3.0-4.2Ghz
- (near J18) RX_IN
- 2.1-3.0Ghz
- 0.0-2.1Ghz
- (near J21) RX_OUT_NA
- 0.0-1.2Ghz
- RX_OUT
- (near J17) TX_OUT/RX_DI_IN
- (near Z23) 0.0-2.1Ghz
- (near Z24) 0.0-1.2Ghz
- (near J19) TX_IN
- PCIe x4 to M.2 ket E adapter and RF frontend: Main RF FE
- License: CERN-OHL-P
- 3
- Wevelet Lab

### Library data of the parts
C85-C87 C90-C92 C98 C99 C101 = GRM155R71E104KE14D: as C1 on sheet PowerControl
C88 C93-C96 C102 C108 C109 = Cap-0402-NP0-50V-100p-20%: Capacitor, 100p, 50V, 20%, NP0, 0402; Manufacturer: *
C97 C100 = NFM15PC146R0G3D: Capacitor feedthru, 14u, 4V, 20%, 2A, 0402; Manufacturer: Murata Electronics; Name: NFM15PC146R0G3D
J17-J21 = CONMHF4-SMD-G-T: Conn, IPEX MHF4, Male Pin, 50 Ohm, -65/+165, SMD; Manufacturer: Linx Technologies Inc.; Name: CONMHF4-SMD-G-T
L46-L48 L50 L56 = BLM15HD182SN1D: Ferrite bead, 1800Ohm@100MHz, 0,2A, 2.2Ohm, -55/+125, SMD0402; Manufacturer: Murata Electronics; Name: BLM15HD182SN1D
L51 L54 = BLM15HG601SN1D: as L3-L6 on sheet PowerControl; Name: BLM15HG601SN1D
L52 L53 = MLK1005S18NJT000: Inductor, 18n, -55/+125, SMD0402; Manufacturer: TDK; Name: MLK1005S18NJT000
Mech5 = BMI-S-205-F: EMI Gaskets, Sheets, Absorbers & Shielding; Manufacturer: Laird Performance Materials; Value: BMI-S-205-F
R117 R124 = Res-0402-3.32K-1%: Resistor, 3.32K, 0.063W, 1%, 0402; Manufacturer: *; Name: RC0402FR-073K32L
R118 R119 = Res-0402-68-5%: Resistor, 68, 0.063W, 5%, 0402; Manufacturer: *; Name: RC0402FR-0768RL
R120 = Res-0402-150-5%: Resistor, 150, 0.063W, 5%, 0402; Manufacturer: *; Name: RC0402FR-07150RL
R121 R122 = Res-0402-50-5%: Resistor, 50, 0.063W, 5%, 0402; Manufacturer: *; Name: RC0402FR-0750RL
R123 = Res-0402-DNP: Resistor, DNP, 0.063W, 5%, 0402; Manufacturer: *
R136 R137 = Res-0402-56K-5%: Resistor, 56K, 0.063W, 5%, 0402; Manufacturer: *; Name: RC0402FR-0756KL
U38-U41 = RFSW6042: IC, Switch, SP4T, 5-6000MHz, -40/+85, / 12-QFN; Manufacturer: Qorvo; Value: RFSW6042TR7
U42 U45 = QPL9547: IC, 0.1 -6 GHz Ultra Low-Noise LNA, SON-8; Manufacturer: QORVO; Value: QPL9547TR7
U43 U46 = BGS12P2L6E6327XTSA1: IC, RF switch, SPDT, 50Ohm -40/+85, TSLP-6-4; Manufacturer: Infineon Technologies; Value: BGS12P2L6E6327XTSA1
U44 = QPC3223: IC, Digital step attenuator, -40/+105, QFN-12; Manufacturer: QORVO; Value: QPC3223SR
Z22 = LFCG-400+: Filter Low Pass, 50Ohm, 400MHz, 30dB, -55/+125, SMD; Manufacturer: Mini-Circuits; Value: LFCG-400+
Z23 Z26 = DEA202025LT-5052C1: RF FILTER, 1880-2023MHZ  -40/+85, 0805; Manufacturer: TDK Corporation; Value: DEA202025LT-5052C1
Z24 Z25 = LFL0Q806MTR3E981: RF FILTER, 0-1200MHZ  -40/+85, Smd; Manufacturer: Murata Electronics; Value: LFL0Q806MTR3E981
Z27 = DEA163750BT-3059A1: RF FILTER, 3300-4200MHZ  -40/+85, 0603; Manufacturer: TDK Corporation; Value: DEA163750BT-3059A1
Z28 = DEA162495BT-1289A1: RF FILTER, 2300-2690MHZ  -40/+85, 0603; Manufacturer: TDK Corporation; Value: DEA162495BT-1289A1
Z29 = HHM22152A2: Signal Coupler, 450-3800MHz, -40/+105, SMD; Manufacturer: TDK; Value: HHM22152A2
Z30 Z31 = DEA103800LT-6328B3: Filter Low Pass, 2.25GHz, 4.6dB, -40/+85, SMD; Manufacturer: TDK Corporation; Value: DEA103800LT-6328B3

## Sheet RFE_Cellularv2_1.SchDoc
size A4
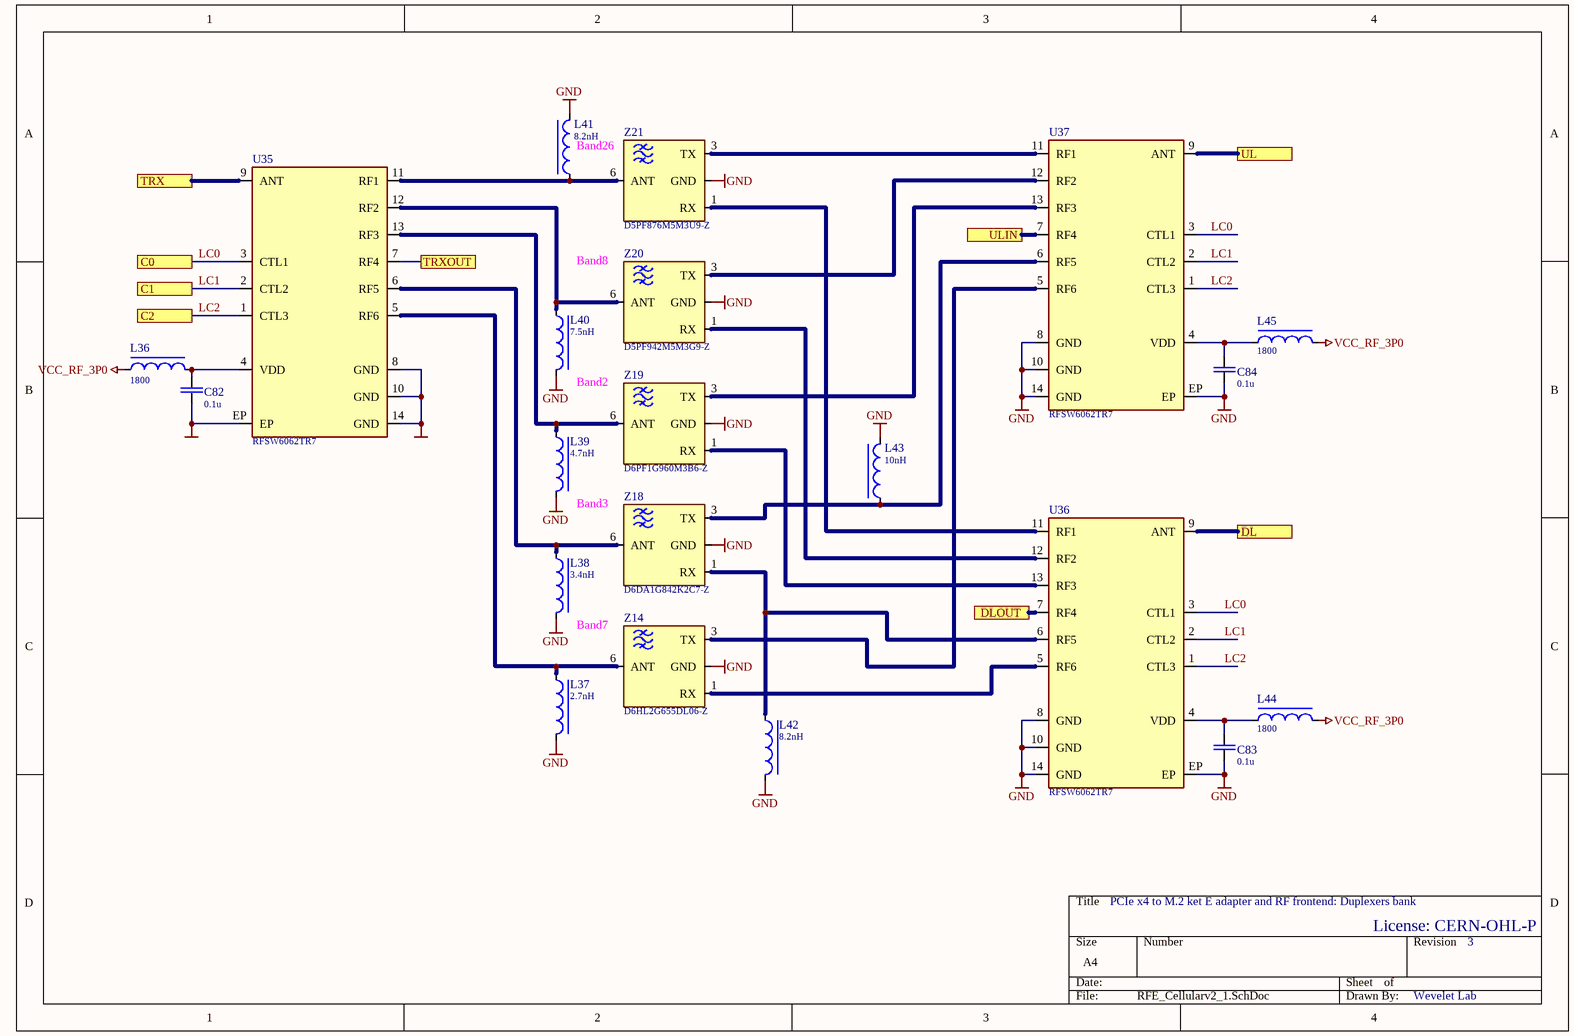
[diagram p7: RFE_Cellularv2_1.SchDoc]

### Parts
C82  value 0.1u  [CAPC100X50X55L25N]  (hidden comment: GRM155R71E104KE14D)
C83  value 0.1u  [CAPC100X50X55L25N]  (hidden comment: GRM155R71E104KE14D)
C84  value 0.1u  [CAPC100X50X55L25N]  (hidden comment: GRM155R71E104KE14D)
L36  value 1800  [INDC100X60X60L30N]  (hidden comment: BLM15HD182SN1D)
L37  value 2.7nH  [INDC60X30X35L15N]  (hidden comment: MLG0603P2N7CT000)
L38  value 3.4nH  [INDC60X30X35L15N]  (hidden comment: MLG0603P3N4BT000)
L39  value 4.7nH  [INDC60X30X35L15N]  (hidden comment: MLG0603P4N7HT000)
L40  value 7.5nH  [INDC60X30X35L15N]  (hidden comment: MLG0603P7N5HT000)
L41  value 8.2nH  [INDC60X30X35L15N]  (hidden comment: MLG0603P8N2HT000)
L42  value 8.2nH  [INDC60X30X35L15N]  (hidden comment: MLG0603P8N2HT000)
L43  value 10nH  [INDC60X30X35L15N]  (hidden comment: MLG0603P10NHT000)
L44  value 1800  [INDC100X60X60L30N]  (hidden comment: BLM15HD182SN1D)
L45  value 1800  [INDC100X60X60L30N]  (hidden comment: BLM15HD182SN1D)
U35  RFSW6062TR7  [QFN15P40_200X200X60L21X18T100N]
U36  RFSW6062TR7  [QFN15P40_200X200X60L21X18T100N]
U37  RFSW6062TR7  [QFN15P40_200X200X60L21X18T100N]
Z14  D6HL2G655DL06-Z  [TAIYO_YUDEN_SMD-9]
Z18  D6DA1G842K2C7-Z  [TAIYO_YUDEN_SMD-8]
Z19  D6PF1G960M3B6-Z  [TAIYO_YUDEN_SMD-9]
Z20  D5PF942M5M3G9-Z  [TAIYO_YUDEN_SMD-9]
Z21  D5PF876M5M3U9-Z  [TAIYO_YUDEN_SMD-9]

### Ports
C0, C1, C2, DL, DLOUT, TRX, TRXOUT, UL, ULIN

### Nets
GND: C82.2 C83.2 C84.2 L37.2 L38.2 L39.2 L40.2 L41.2 L42.2 L43.2 U35.8(GND) U35.10(GND) U35.14(GND) U35.EP U36.8(GND) U36.10(GND) U36.14(GND) U36.EP U37.8(GND) U37.10(GND) U37.14(GND) U37.EP Z14.GND Z18.GND Z19.GND Z20.GND Z21.GND
VCC_RF_3P0: L36.2 L44.2 L45.2
LC0: U35.3(CTL1) U36.3(CTL1) U37.3(CTL1) ; port C0  [project net GCP9]
LC1: U35.2(CTL2) U36.2(CTL2) U37.2(CTL2) ; port C1  [project net GCP10]
LC2: U35.1(CTL3) U36.1(CTL3) U37.1(CTL3) ; port C2  [project net GCP11]
NetC82_1: C82.1 L36.1 U35.4(VDD)
NetC83_1: C83.1 L44.1 U36.4(VDD)
NetC84_1: C84.1 L45.1 U37.4(VDD)
NetC88_1: U37.9(ANT) ; port UL
NetJ17_1: U35.9(ANT) ; port TRX
NetL37_1: L37.1 U35.5(RF6) Z14.6(ANT)
NetL38_1: L38.1 U35.6(RF5) Z18.6(ANT)
NetL39_1: L39.1 U35.13(RF3) Z19.6(ANT)
NetL40_1: L40.1 U35.12(RF2) Z20.6(ANT)
NetL41_1: L41.1 U35.11(RF1) Z21.6(ANT)
NetL42_1: L42.1 U36.6(RF5) Z18.1(RX)
NetL43_1: L43.1 U37.6(RF5) Z18.3(TX)
NetU35_7: U35.7(RF4) ; port TRXOUT
NetU36_5: U36.5(RF6) Z14.1(RX)
NetU36_7: U36.7(RF4) ; port DLOUT
NetU36_9: U36.9(ANT) ; port DL
NetU36_11: U36.11(RF1) Z21.1(RX)
NetU36_12: U36.12(RF2) Z20.1(RX)
NetU36_13: U36.13(RF3) Z19.1(RX)
NetU37_5: U37.5(RF6) Z14.3(TX)
NetU37_7: U37.7(RF4) ; port ULIN
NetU37_11: U37.11(RF1) Z21.3(TX)
NetU37_12: U37.12(RF2) Z20.3(TX)
NetU37_13: U37.13(RF3) Z19.3(TX)

### Notes on the sheet
- Band26
- (near Z20) Band8
- Band2
- Band3
- Band7
- PCIe x4 to M.2 ket E adapter and RF frontend: Duplexers bank
- License: CERN-OHL-P
- 3
- Wevelet Lab

### Library data of the parts
C82-C84 = GRM155R71E104KE14D: as C1 on sheet PowerControl
L36 L44 L45 = BLM15HD182SN1D: as L46-L48 on sheet RFEv2_1; Name: BLM15HD182SN1D
L37 = MLG0603P2N7CT000: Inductor, 2.7n, 0.5A, 200mOhm, -55/+125, SMD0201; Manufacturer: TDK; Name: MLG0603P2N7CT000
L38 = MLG0603P3N4BT000: Inductor, 3.4n, -55/+125, SMD0201; Manufacturer: TDK; Name: MLG0603P3N4BT000
L39 = MLG0603P4N7HT000: Inductor, 4.7n, -55/+125, SMD0201; Manufacturer: TDK; Name: MLG0603P4N7HT000
L40 = MLG0603P7N5HT000: Inductor, 7.5n, -55/+125, SMD0201; Manufacturer: TDK; Name: MLG0603P7N5HT000
L41 L42 = MLG0603P8N2HT000: Inductor, 8.2n, -55/+125, SMD0201; Manufacturer: TDK; Name: MLG0603P8N2HT000
L43 = MLG0603P10NHT000: Inductor, 10n, -55/+125, SMD0201; Manufacturer: TDK; Name: MLG0603P10NHT000
U35-U37 = RFSW6062: IC, Switch, SP6T, 5-6000MHz, -40/+85, / 14-QFN; Manufacturer: Qorvo; Value: RFSW6062TR7
Z14 = D6HL2G655DL06: RF DUPLEXER, Band 7, -20/+85, SMD9; Manufacturer: TAIYO YUDEN; Value: D6HL2G655DL06-Z
Z18 = D6DA1G842K2C7: RF DUPLEXER, Band 3, -20/+85, SMD8; Manufacturer: TAIYO YUDEN; Value: D6DA1G842K2C7-Z
Z19 = D6PF1G960M3B6: RF DUPLEXER, Band 2, -20/+85, SMD9; Manufacturer: TAIYO YUDEN; Value: D6PF1G960M3B6-Z
Z20 = D5PF942M5M3G9: RF DUPLEXER, Band 8, -20/+85, SMD9; Manufacturer: TAIYO YUDEN; Value: D5PF942M5M3G9-Z
Z21 = D5PF876M5M3U9: RF DUPLEXER, Band 26, -20/+85, SMD9; Manufacturer: TAIYO YUDEN; Value: D5PF876M5M3U9-Z

## Nets that join several sheets
GND: PCIe_to_M2E (122 pins), RFEv2 (80 pins), RFE_Cellularv2 (27 pins), PowerControl (98 pins), RFEv2_1 (80 pins), RFE_Cellularv2_1 (27 pins)
VCC5P0: RFEv2 (5 pins), PowerControl (6 pins), RFEv2_1 (5 pins)
VCC_1P8: PCIe_to_M2E (15 pins), RFEv2 (C75.1 C78.1), PowerControl (20 pins), RFEv2_1 (C97.1 C100.1)
VCC_3P45: PCIe_to_M2E (11 pins), PowerControl (16 pins)
VCC_GPS_3P0: PCIe_to_M2E (C59.3), PowerControl (C21.1 R24.2 R32.2 U9.1)
VCC_OSC_3P0: PCIe_to_M2E (C40.3 C46.1), PowerControl (C29.1 R31.2 R48.2 U14.1)
VCC_RF_3P0: RFEv2 (L18.1 L19.1 L20.2 L22.2), RFE_Cellularv2 (L15.2 L16.2 L17.2), PowerControl (C105.1 R125.2 R126.1), RFEv2_1 (L46.1 L47.1 L48.2 L50.2), RFE_Cellularv2_1 (L36.2 L44.2 L45.2)
VCC_USB: PCIe_to_M2E (5 pins), PowerControl (U2.7)
VIN_12P0: PCIe_to_M2E (6 pins), PowerControl (7 pins)
CFG_PCIE: PCIe_to_M2E (6 pins), PowerControl (R13.2 U7.5)
CFG_USB3: PCIe_to_M2E (5 pins), PowerControl (R14.2 U8.5)
EN_GPS: PCIe_to_M2E (R84.2 U13.6), PowerControl (R97.2 U1.2 U9.5)
EN_OSC: PCIe_to_M2E (R85.2), PowerControl (R99.2 U1.1 U14.5)
EN_RFE: PCIe_to_M2E (U15.14), RFEv2 (R128.2 U33.6)
EN_RFE2: PCIe_to_M2E (U15.7), RFEv2_1 (R137.2 U45.6)
EN_RFE_LNA: PCIe_to_M2E (U15.12), RFEv2 (R127.2 U30.6)
EN_RFE_LNA2: PCIe_to_M2E (U15.13), RFEv2_1 (R136.2 U42.6)
FGCP8: PCIe_to_M2E (R64.2 R82.2), RFEv2 (U31.6 U34.6), RFEv2_1 (U43.6 U46.6)
FGCP12: PCIe_to_M2E (R63.2 R92.2), RFEv2 (U32.11), RFEv2_1 (U44.11)
FGCP13: PCIe_to_M2E (R62.2 R91.2), RFEv2 (U32.10), RFEv2_1 (U44.10)
GCP0: PCIe_to_M2E (U15.5), RFEv2 (U27.2 U29.2), RFEv2_1 (U39.2 U41.2)
GCP1: PCIe_to_M2E (U15.4), RFEv2 (U27.1), RFEv2_1 (U39.1)
GCP3: PCIe_to_M2E (U15.6), RFEv2 (U29.1), RFEv2_1 (U41.1)
GCP4: PCIe_to_M2E (U15.2), RFEv2 (U26.2 U28.2), RFEv2_1 (U38.2 U40.2)
GCP5: PCIe_to_M2E (U15.3), RFEv2 (U26.1), RFEv2_1 (U38.1)
GCP7: PCIe_to_M2E (U15.1), RFEv2 (U28.1), RFEv2_1 (U40.1)
GCP9: PCIe_to_M2E (U15.8), RFE_Cellularv2 (U23.3 U24.3 U25.3), RFE_Cellularv2_1 (U35.3 U36.3 U37.3)
GCP10: PCIe_to_M2E (U15.10), RFE_Cellularv2 (U23.2 U24.2 U25.2), RFE_Cellularv2_1 (U35.2 U36.2 U37.2)
GCP11: PCIe_to_M2E (U15.11), RFE_Cellularv2 (U23.1 U24.1 U25.1), RFE_Cellularv2_1 (U35.1 U36.1 U37.1)
GPIO6: PCIe_to_M2E (J5.54 U20.6), PowerControl (U6.2)
GPIO7: PCIe_to_M2E (J5.56 U20.1), PowerControl (U6.3)
GPIO8: PCIe_to_M2E (J5.32 U20.2), PowerControl (U5.2)
GPIO9: PCIe_to_M2E (J5.34 U20.3), PowerControl (U5.3)
GPIO10: PCIe_to_M2E (J5.36 U20.7), PowerControl (U4.2)
GPIO11: PCIe_to_M2E (J5.22 U20.5), PowerControl (U4.3)
GPIO14: PCIe_to_M2E (J5.68), PowerControl (U12.2)
GPIO15: PCIe_to_M2E (J5.70), PowerControl (U12.3)
GPIO_LED3#: PCIe_to_M2E (D12.C), PowerControl (Q3.1 U1.17)
GPIO_LED4#: PCIe_to_M2E (D13.C), PowerControl (Q2.1 U1.16)
I2C_INTR: PCIe_to_M2E (R83.2), PowerControl (U1.22)
NetC66_1: RFEv2 (C66.1), RFE_Cellularv2 (U25.9)
NetC88_1: RFEv2_1 (C88.1), RFE_Cellularv2_1 (U37.9)
NetJ12_1: RFEv2 (J12.1), RFE_Cellularv2 (U23.9)
NetJ17_1: RFEv2_1 (J17.1), RFE_Cellularv2_1 (U35.9)
NetU23_7: RFEv2 (U26.7), RFE_Cellularv2 (U23.7)
NetU24_7: RFEv2 (U28.7), RFE_Cellularv2 (U24.7)
NetU24_9: RFEv2 (Z17.3), RFE_Cellularv2 (U24.9)
NetU25_7: RFEv2 (U29.7), RFE_Cellularv2 (U25.7)
NetU35_7: RFEv2_1 (U38.7), RFE_Cellularv2_1 (U35.7)
NetU36_7: RFEv2_1 (U40.7), RFE_Cellularv2_1 (U36.7)
NetU36_9: RFEv2_1 (Z29.3), RFE_Cellularv2_1 (U36.9)
NetU37_7: RFEv2_1 (U41.7), RFE_Cellularv2_1 (U37.7)
PCI_PERST#: PCIe_to_M2E (J2.A11 J5.52), PowerControl (R7.1)
SCL: PCIe_to_M2E (7 pins), PowerControl (U1.19)
SDA: PCIe_to_M2E (7 pins), PowerControl (U1.20)

## Assembly variants
CS: not fitted C32 C47 C50 C60 C61 C62 C63 C64 C65 C66 C68 C69 C70 C71 C72 C73 C74 C75 C76 C77 C78 C79 C80 C89 C103 D12 D13 J1 J4 J7 J7 J8 J8 J10 J11 J12 J13 J14 J15 J16 J21 J23 L7 L15 L16 L17 L18 L19 L20 L22 L23 L24 L25 L26 L28 L29 L30 L31 L32 L33 L34 L35 Mech2 Mech3 Mech4 R1 R13 R14 R16 R18 R20 R21 R22 R54 R58 R59 R60 R61 R62 R63 R64 R66 R67 R68 R74 R77 R81 R83 R84 R85 R89 R90 R100 R103 R107 R108 R110 R111 R112 R113 R114 R115 R116 R123 R125 R127 R128 R129 U16 U20 U23 U24 U25 U26 U27 U28 U29 U30 U31 U32 U33 U34 Z1 Z2 Z3 Z4 Z5 Z6 Z7 Z8 Z9 Z10 Z11 Z12 Z13 Z15 Z16 Z17